# Altium schematic sheet UART.SCHDOC
size A4; SheetNumber: 4
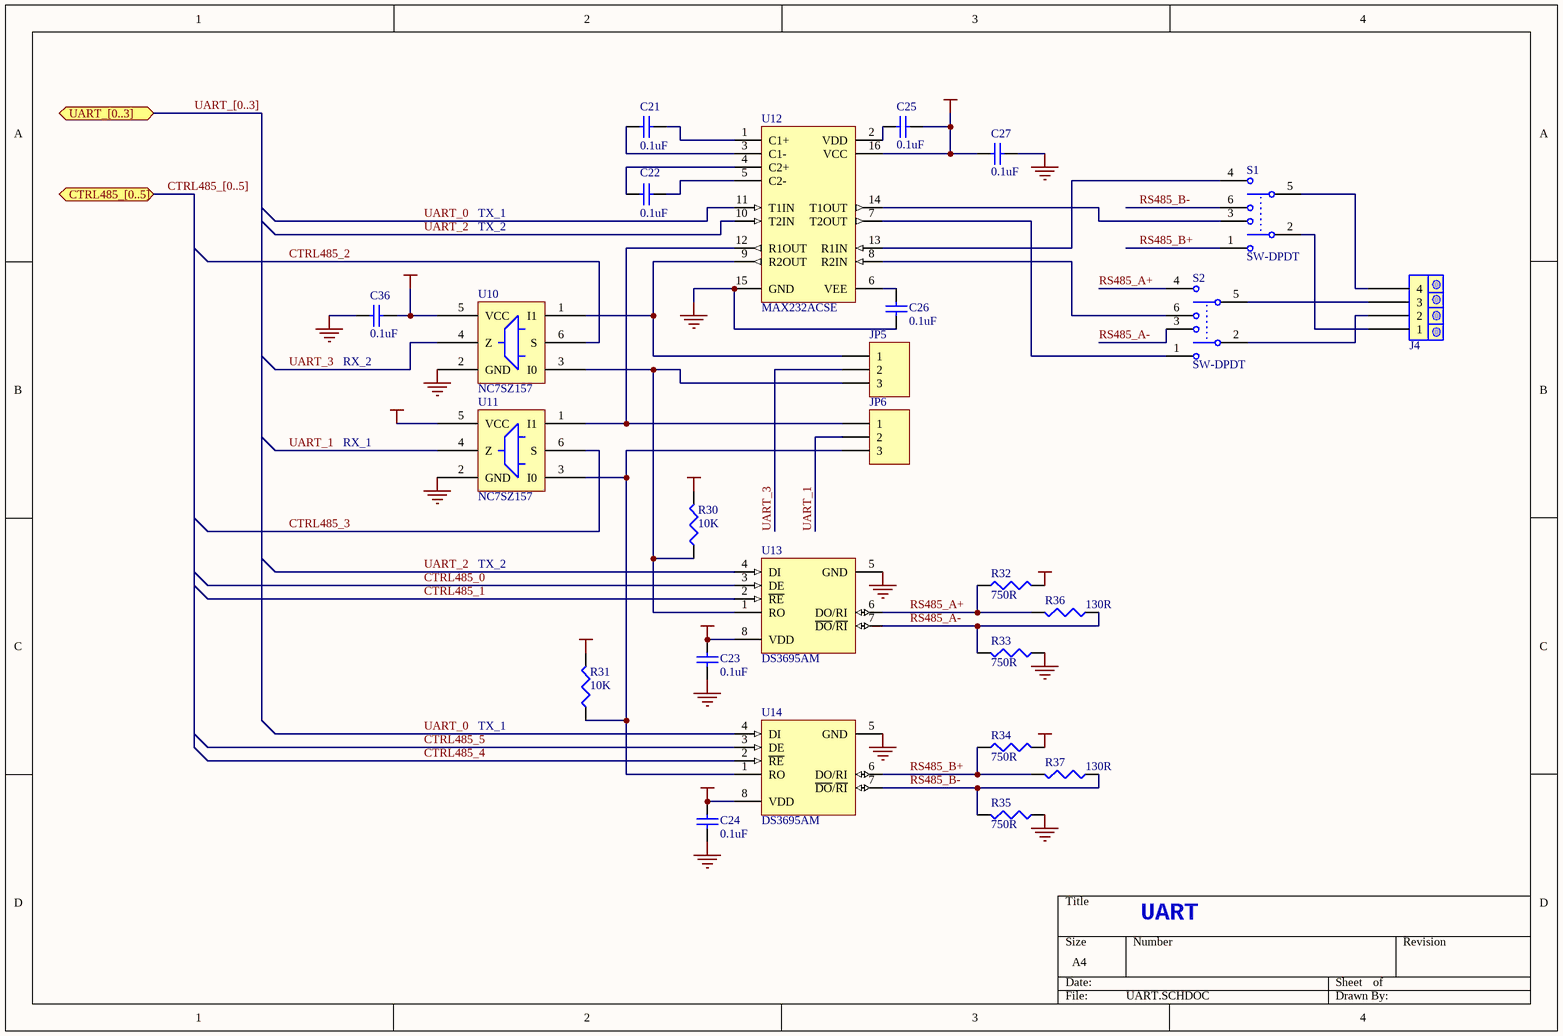
[diagram p0: UART.SCHDOC]

## Parts
C21  value 0.1uF  [_0805]  (hidden comment: Cap Semi)
C22  value 0.1uF  [_0805]  (hidden comment: Cap Semi)
C23  value 0.1uF  [_0805]  (hidden comment: Cap Semi)
C24  value 0.1uF  [_0805]  (hidden comment: Cap Semi)
C25  value 0.1uF  [_0805]  (hidden comment: Cap Semi)
C26  value 0.1uF  [_0805]  (hidden comment: Cap Semi)
C27  value 0.1uF  [_0805]  (hidden comment: Cap Semi)
C36  value 0.1uF  [_0805]  (hidden comment: Cap Semi)
J4  BORNERA_X4  [BORNERA_X4]  (value not drawn)
JP5  Header 3  [HDR1X3]  (value not drawn)
JP6  Header 3  [HDR1X3]  (value not drawn)
R30  value 10K  [_0805]  (hidden comment: Res3)
R31  value 10K  [_0805]  (hidden comment: Res3)
R32  value 750R  [_1206]  (hidden comment: Res3)
R33  value 750R  [_1206]  (hidden comment: Res3)
R34  value 750R  [_1206]  (hidden comment: Res3)
R35  value 750R  [_1206]  (hidden comment: Res3)
R36  value 130R  [_1206]  (hidden comment: Res3)
R37  value 130R  [_1206]  (hidden comment: Res3)
S1  SW-DPDT  [Switch_EG2207]
S2  SW-DPDT  [Switch_EG2207]
U10  NC7SZ157  [SO-G6/Z2.8]
U11  NC7SZ157  [SO-G6/Z2.8]
U12  MAX232ACSE  [NSO16]
U13  DS3695AM  [M08A]
U14  DS3695AM  [M08A]

## Ports
CTRL485_[0..5] (bidir), UART_[0..3] (bidir)

## Nets
GND: C23.2 C24.2 C26.2 C27.2 C36.1 R33.1 R35.1 U10.2(GND) U11.2(GND) U12.15(GND) U13.5(GND) U14.5(GND)
VCC_3V: C36.2 U10.5(VCC) U11.5(VCC)
VCC_5V: C23.1 C24.1 C25.1 C27.1 R30.2 R31.2 R32.2 R34.2 U12.16(VCC) U13.8(VDD) U14.8(VDD)
CTRL485_0: U13.3(DE)
CTRL485_1: U13.2(~{RE})
CTRL485_2: U10.6(S)
CTRL485_3: U11.6(S)
CTRL485_4: U14.2(~{RE})
CTRL485_5: U14.3(DE)
RS485_A+: R32.1 R36.2 S2.4 U13.6(DO/RI)
RS485_A-: R33.2 R36.1 S2.3 U13.7(~{DO}/~{RI})
RS485_B+: R34.1 R37.2 S1.1 U14.6(DO/RI)
RS485_B-: R35.2 R37.1 S1.6 U14.7(~{DO}/~{RI})
UART_0: U12.11(T1IN) U14.4(DI)
UART_1: JP6.2 U11.4(Z)
UART_2: U12.10(T2IN) U13.4(DI)
UART_3: JP5.2 U10.4(Z)
NetC21_1: C21.1 U12.3(C1-)
NetC21_2: C21.2 U12.1(C1+)
NetC22_1: C22.1 U12.4(C2+)
NetC22_2: C22.2 U12.5(C2-)
NetC25_2: C25.2 U12.2(VDD)
NetC26_1: C26.1 U12.6(VEE)
NetJ4_1: J4.1 S1.2
NetJ4_2: J4.2 S2.2
NetJ4_3: J4.3 S2.5
NetJ4_4: J4.4 S1.5
NetJP5_1: JP5.1 U10.1(I1) U12.9(R2OUT)
NetJP5_3: JP5.3 R30.1 U10.3(I0) U13.1(RO)
NetJP6_1: JP6.1 U11.1(I1) U12.12(R1OUT)
NetJP6_3: JP6.3 R31.1 U11.3(I0) U14.1(RO)
NetS1_3: S1.3 U12.14(T1OUT)
NetS1_4: S1.4 U12.13(R1IN)
NetS2_1: S2.1 U12.7(T2OUT)
NetS2_6: S2.6 U12.8(R2IN)

## Buses and harness runs
bus CTRL485_[0..5] = port CTRL485_[0..5]
bus UART_[0..3] = port UART_[0..3]

## Notes on the sheet
- TX_1
- TX_2
- (near C36) RX_2
- RX_1
- UART

## Library data of the parts
C21-C27 C36 = Cap Semi: Capacitor (Semiconductor SIM Model); Published: 8-Jun-2000; Revision: July-2002: Re-released for DXP Platform.; Publisher: Altium Limited
JP5 JP6 = Header 3: Header, 3-Pin; Revision: 17-Jul-2002: Re-released for DXP Platform.; Publisher: Altium Limited
R30-R37 = Res3: Resistor; Published: 8-Jun-2000; Revision: July-2002: Re-released for DXP Platform.; Publisher: Altium Limited
S1 S2 = SW-DPDT: Double-Pole, Double-Throw Switch; Published: 24-Mar-1999; Revision: July-2002: Re-released for DXP Platform.; Publisher: Altium Limited
U10 U11 = NC7SZ157: Tiny Logic 2-Input Non-Inverter Mux
U12 = MAX232ACSE: +5V Powered, Multi-Channel RS-232 Driver/Receiver; Code - JEDEC: MS-012-AC; Code - IPC: SO16; Published: 16-Jan-2001; Revision: 17-Jul-2002: Re-released for DXP Platform.; Package Reference: NSO16; Publisher: Altium Limited
U13 U14 = DS3695AM: Multipoint RS485/RS422 Transceiver; Package Information: Latest Revision: Sep-1997; Code - JEDEC: MS-012-AA; Code - IPC: SO8; Published: 15-Apr-2002; Datasheet: Latest Revision: Feb-1996; Package Reference: M08A; Publisher: Altium Limited